# Altium schematic sheet Sheet1.SchDoc
size A4
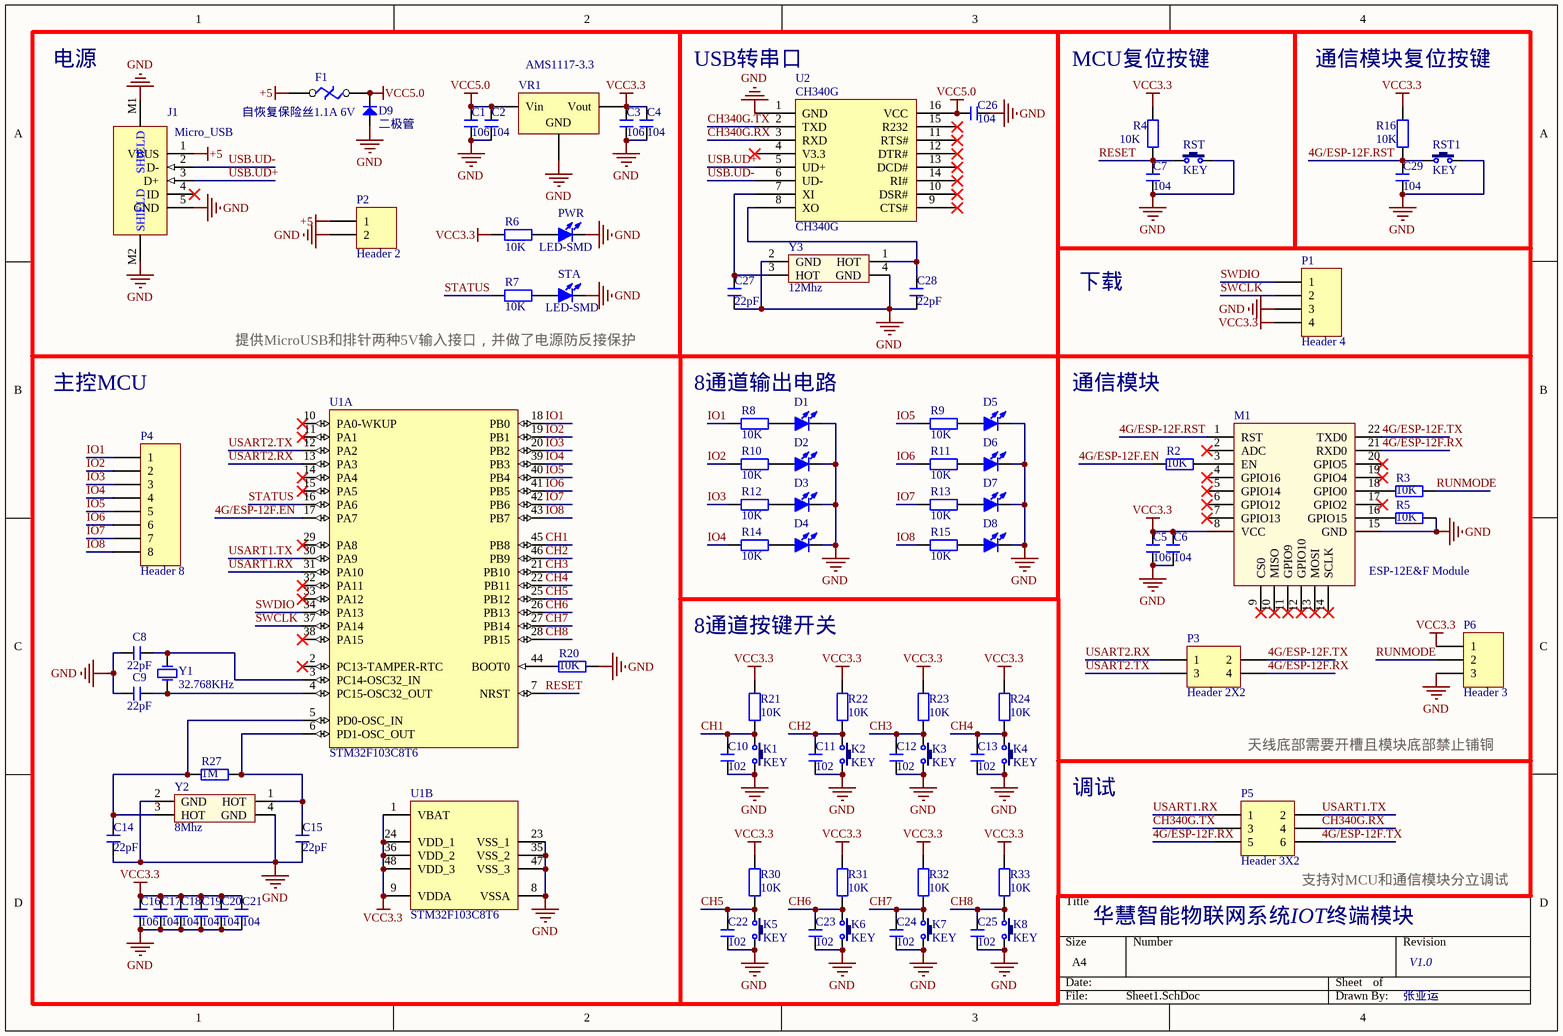
[diagram p0: Sheet1.SchDoc]

## Parts
C1  106  [LC-0603_C]
C2  104  [LC-0603_C]
C3  106  [LC-0603_C]
C4  104  [LC-0603_C]
C5  106  [LC-0603_C]
C6  104  [LC-0603_C]
C7  104  [LC-0603_C]
C8  22pF  [LC-0603_C]
C9  22pF  [LC-0603_C]
C10  102  [LC-0603_C]
C11  102  [LC-0603_C]
C12  102  [LC-0603_C]
C13  102  [LC-0603_C]
C14  22pF  [LC-0603_C]
C15  22pF  [LC-0603_C]
C16  106  [LC-0603_C]
C17  104  [LC-0603_C]
C18  104  [LC-0603_C]
C19  104  [LC-0603_C]
C20  104  [LC-0603_C]
C21  104  [LC-0603_C]
C22  102  [LC-0603_C]
C23  102  [LC-0603_C]
C24  102  [LC-0603_C]
C25  102  [LC-0603_C]
C26  104  [LC-0603_C]
C27  22pF  [LC-0603_C]
C28  22pF  [LC-0603_C]
C29  104  [LC-0603_C]
D1  LED-SMD  [LC-0603_LED_S1]  (value not drawn)
D2  LED-SMD  [LC-0603_LED_S1]  (value not drawn)
D3  LED-SMD  [LC-0603_LED_S1]  (value not drawn)
D4  LED-SMD  [LC-0603_LED_S1]  (value not drawn)
D5  LED-SMD  [LC-0603_LED_S1]  (value not drawn)
D6  LED-SMD  [LC-0603_LED_S1]  (value not drawn)
D7  LED-SMD  [LC-0603_LED_S1]  (value not drawn)
D8  LED-SMD  [LC-0603_LED_S1]  (value not drawn)
D9  二极管  [LC-SOD-323]
F1  自恢复保险丝1.1A 6V  [LC-1206_R]
J1  Micro_USB  [USB-MICRO_B]
K1  KEY  [SWT3*4]
K2  KEY  [SWT3*4]
K3  KEY  [SWT3*4]
K4  KEY  [SWT3*4]
K5  KEY  [SWT3*4]
K6  KEY  [SWT3*4]
K7  KEY  [SWT3*4]
K8  KEY  [SWT3*4]
M1  ESP-12E&F Module  [ESP-12E&F Module]
P1  Header 4  [HDR1X4]
P2  Header 2  [HDR1X2]
P3  Header 2X2  [HDR2X2]
P4  Header 8  [HDR1X8]
P5  Header 3X2  [HDR2X3]
P6  Header 3  [HDR1X3]
PWR  LED-SMD  [LC-0603_LED_S1]
R2  10K  [LC-0603_R]
R3  10K  [LC-0603_R]
R4  10K  [LC-0603_R]
R5  10K  [LC-0603_R]
R6  10K  [LC-0603_R]
R7  10K  [LC-0603_R]
R8  10K  [LC-0603_R]
R9  10K  [LC-0603_R]
R10  10K  [LC-0603_R]
R11  10K  [LC-0603_R]
R12  10K  [LC-0603_R]
R13  10K  [LC-0603_R]
R14  10K  [LC-0603_R]
R15  10K  [LC-0603_R]
R16  10K  [LC-0603_R]
R20  10K  [LC-0603_R]
R21  10K  [LC-0603_R]
R22  10K  [LC-0603_R]
R23  10K  [LC-0603_R]
R24  10K  [LC-0603_R]
R27  1M  [LC-0603_R]
R30  10K  [LC-0603_R]
R31  10K  [LC-0603_R]
R32  10K  [LC-0603_R]
R33  10K  [LC-0603_R]
RST  KEY  [SWT3*4]
RST1  KEY  [SWT3*4]
STA  LED-SMD  [LC-0603_LED_S1]
U1  STM32F103C8T6  [STM-LQFP48_L]  (parts A,B of 2)
U2  CH340G  [SOIC-16_150mil]
VR1  AMS1117-3.3  [LC-SOT-223]
Y1  32.768KHz  [LC-SMD-3215_2P FC - 135]
Y2  8Mhz  [LC-SMD-3225_4P]
Y3  12Mhz  [LC-SMD-3225_4P]

## Nets
+5: F1.1 J1.1(VBUS) P2.1
GND: C1.2 C2.2 C3.2 C4.2 C5.2 C6.2 C7.1 C8.1 C9.1 C10.2 C11.2 C12.2 C13.2 C14.2 C15.2 C16.2 C17.2 C18.2 C19.2 C20.2 C21.2 C22.2 C23.2 C24.2 C25.2 C26.1 C27.2 C28.2 C29.1 D1.2(K) D2.2(K) D3.2(K) D4.2(K) D5.2(K) D6.2(K) D7.2(K) D8.2(K) D9.1 J1.5(GND) J1.M1(SHIELD) J1.M2(SHIELD) K1.2 K2.2 K3.2 K4.2 K5.2 K6.2 K7.2 K8.2 M1.15(GND) P1.3 P2.2 P6.3 PWR.2(K) R5.1 R20.1 RST.2 RST1.2 STA.2(K) U1.8(VSSA) U1.23(VSS_1) U1.35(VSS_2) U1.47(VSS_3) U2.1(GND) VR1.1(GND) Y2.2(GND) Y2.4(GND) Y3.2(GND) Y3.4(GND)
VCC3.3: C3.1 C4.1 C5.1 C6.1 C16.1 C17.1 C18.1 C19.1 C20.1 C21.1 M1.8(VCC) P1.4 P6.1 R4.2 R6.1 R16.2 R21.1 R22.1 R23.1 R24.1 R30.1 R31.1 R32.1 R33.1 U1.1(VBAT) U1.9(VDDA) U1.24(VDD_1) U1.36(VDD_2) U1.48(VDD_3) VR1.2(Vout)
VCC5.0: C1.1 C2.1 C26.2 D9.2 F1.2 U2.16(VCC) VR1.3(Vin)
4G/ESP-12F.EN: R2.2 U1.17(PA7)
4G/ESP-12F.RST: C29.2 M1.1(RST) R16.1 RST1.1
4G/ESP-12F.RX: M1.21(RXD0) P3.4 P5.5
4G/ESP-12F.TX: M1.22(TXD0) P3.2 P5.6
CH1: C10.1 K1.1 R21.2 U1.45(PB8)
CH2: C11.1 K2.1 R22.2 U1.46(PB9)
CH3: C12.1 K3.1 R23.2 U1.21(PB10)
CH4: C13.1 K4.1 R24.2 U1.22(PB11)
CH5: C22.1 K5.1 R30.2 U1.25(PB12)
CH6: C23.1 K6.1 R31.2 U1.26(PB13)
CH7: C24.1 K7.1 R32.2 U1.27(PB14)
CH8: C25.1 K8.1 R33.2 U1.28(PB15)
CH340G.RX: P5.4 U2.3(RXD)
CH340G.TX: P5.3 U2.2(TXD)
IO1: P4.1 R8.1 U1.18(PB0)
IO2: P4.2 R10.1 U1.19(PB1)
IO3: P4.3 R12.1 U1.20(PB2)
IO4: P4.4 R14.1 U1.39(PB3)
IO5: P4.5 R9.1 U1.40(PB4)
IO6: P4.6 R11.1 U1.41(PB5)
IO7: P4.7 R13.1 U1.42(PB6)
IO8: P4.8 R15.1 U1.43(PB7)
RESET: C7.2 R4.1 RST.1 U1.7(NRST)
RUNMODE: P6.2 R3.1
STATUS: R7.1 U1.16(PA6)
SWCLK: P1.2 U1.37(PA14)
SWDIO: P1.1 U1.34(PA13)
USART1.RX: P5.1 U1.31(PA10)
USART1.TX: P5.2 U1.30(PA9)
USART2.RX: P3.1 U1.13(PA3)
USART2.TX: P3.3 U1.12(PA2)
USB.UD+: J1.3(D+) U2.5(UD+)
USB.UD-: J1.2(D-) U2.6(UD-)
NetC8_2: C8.2 U1.3(PC14-OSC32_IN) Y1.2(OSC2)
NetC9_2: C9.2 U1.4(PC15-OSC32_OUT) Y1.1(OSC1)
NetC14_1: C14.1 R27.2 U1.5(PD0-OSC_IN) Y2.3(HOT)
NetC15_1: C15.1 R27.1 U1.6(PD1-OSC_OUT) Y2.1(HOT)
NetC27_1: C27.1 U2.7(XI) Y3.3(HOT)
NetC28_1: C28.1 U2.8(XO) Y3.1(HOT)
NetD1_1: D1.1(A) R8.2
NetD2_1: D2.1(A) R10.2
NetD3_1: D3.1(A) R12.2
NetD4_1: D4.1(A) R14.2
NetD5_1: D5.1(A) R9.2
NetD6_1: D6.1(A) R11.2
NetD7_1: D7.1(A) R13.2
NetD8_1: D8.1(A) R15.2
NetM1_3: M1.3(EN) R2.1
NetM1_16: M1.16(GPIO15) R5.2
NetM1_18: M1.18(GPIO0) R3.2
NetPWR_1: PWR.1(A) R6.2
NetR7_2: R7.2 STA.1(A)
NetR20_2: R20.2 U1.44(BOOT0)

Not connected (* = marked no-connect by the designer): J1 4(ID)*; M1 2(ADC)* 4(GPIO16)* 5(GPIO14)* 6(GPIO12)* 7(GPIO13)* 9(CS0)* 10(MISO)* 11(GPIO9)* 12(GPIO10)* 13(MOSI)* 14(SCLK)* 17(GPIO2)* 19(GPIO4)* 20(GPIO5)*; U1 2(PC13-TAMPER-RTC)* 10(PA0-WKUP)* 11(PA1)* 14(PA4)* 15(PA5)* 29(PA8)* 32(PA11)* 33(PA12)* 38(PA15)*; U2 4(V3.3)* 9(CTS#)* 10(DSR#)* 11(RTS#)* 12(DTR#)* 13(DCD#)* 14(RI#)* 15(R232)*

## Notes on the sheet
- 电源
- USB转串口
- (near R4) MCU复位按键
- (near R16) 通信模块复位按键
- 下载
- 提供MicroUSB和排针两种5V输入接口，并做了电源防反接保护
- 主控MCU
- 8通道输出电路
- 通信模块
- 8通道按键开关
- 天线底部需要开槽且模块底部禁止铺铜
- 调试
- 华慧智能物联网系统IOT终端模块
- (near P5) 支持对MCU和通信模块分立调试
- V1.0
- 张亚运

## Library data of the parts
C1-C29 = C: 无极性贴片电容; 版权归属: 源创客; BOM名称: 无极性贴片电容; 学习资源: www.ooocke.com
D1-D8 PWR STA = LED-SMD: 贴片LED; 版权归属: 源创客; BOM名称: 贴片LED; 学习资源: www.ooocke.com
D9 = 二极管: 普通二极管
F1 = F: 1206 贴片自恢复保险丝/保险管 PPTC MF-NSMF110-2 1.1A 6V
K1-K8 RST RST1 = KEY: 按键; BOM名称: 3x6轻触开关; 版权归属: 源创客; 学习资源: www.ooocke.com
P1 = Header 4: Header, 4-Pin; LatestRevisionDate: 17-Jul-2002; LatestRevisionNote: Re-released for DXP Platform.; Publisher: Altium Limited
P2 = Header 2: Header, 2-Pin; LatestRevisionDate: 17-Jul-2002; LatestRevisionNote: Re-released for DXP Platform.; Publisher: Altium Limited
P3 = Header 2X2: Header, 2-Pin, Dual row; LatestRevisionDate: 17-Jul-2002; LatestRevisionNote: Re-released for DXP Platform.; Publisher: Altium Limited
P4 = Header 8: Header, 8-Pin; LatestRevisionDate: 17-Jul-2002; LatestRevisionNote: Re-released for DXP Platform.; Publisher: Altium Limited
P5 = Header 3X2: Header, 3-Pin, Dual row; LatestRevisionDate: 17-Jul-2002; LatestRevisionNote: Re-released for DXP Platform.; Publisher: Altium Limited
P6 = Header 3: Header, 3-Pin; LatestRevisionDate: 17-Jul-2002; LatestRevisionNote: Re-released for DXP Platform.; Publisher: Altium Limited
R2-R16 R20-R24 R27 R30-R33 = R: 电阻; ComponentLink1Description: 供应商链接; ComponentLink1URL: http://www.szlcsc.com/product/details_24078.html; Package: 0603; Supplier: LC; SuppliersPartNumber: C23345
U1 = STM32F103C8T6: ARM Cortex-M3 32-bit MCU, 64 KB Flash, 20 KB Internal RAM, 37 I/Os, 48-pin LQFP, -40 to 85 degC, Tray; A/D Converter: 2x12-bit (10 Channel); FLASH Size (Prog) (kB): 64; I/Os (High Current): 37; Internal RAM Size (kB): 20; Operating Frequency(F) (Processor speed) (MHz): 72; Supply Voltage(Vcc) min (V): 2; DatasheetVersion: Rev. 16; PackageVersion: Rev. 6, 06/2013; PackageReference: LQFP48; PackageDescription: 48-Pin Low Profile Quad Flat Package, 7 x 7 mm Body, 0.5 mm Pitch; Supplier 1: Digi-Key; Supplier Part Number 1: 497-6063-ND; Supplier 2: Farnell; Supplier Part Number 2: 1447637; Supplier 3: Newark; Supplier Part Number 3: 59M2182; Supplier 4: Newark; Supplier Part Number 4: 57P1222; Supplier 5: Mouser; Supplier Part Number 5: 511-STM32F103C8T6; Core: ARM Cortex-M3; Packing: Tray; Mounting Technology: Surface Mount; PartNumber: STM32F103C8T6; ComponentLink1Description: Manufacturer URL; ComponentLink1URL: http://www.st.com/web/en/home.html; ComponentLink2Description: Datasheet; ComponentLink2URL: http://www.st.com/st-web-ui/static/active/en/resource/technical/document/datasheet/CD00161566.pdf; ComponentLink3Description: Package Specification; ComponentLink3URL: http://www.st.com/st-web-ui/static/active/en/resource/technical/document/datasheet/DM00058181.pdf
U2 = CH340G: USB; ComponentLink1Description: 供应商链接; ComponentLink1URL: http://www.szlcsc.com/product/details_14927.html; Package: SOIC-16_150mil; Supplier: LC; SuppliersPartNumber: C14267
VR1 = SOT-223 AMS1117-3.3: 低压差线性稳压(LDO); ComponentLink1Description: 供应商链接; ComponentLink1URL: http://www.szlcsc.com/product/details_6652.html; Package: SOT-223; Supplier: LC; SuppliersPartNumber: C6186
Y1 = XTAL: 普通晶振; Published: 8-Jun-2000; LatestRevisionDate: 17-Jul-2002; LatestRevisionNote: Re-released for DXP Platform.; Publisher: Altium Limited
Y2 Y3 = XTAL_3225: 3225贴片无源晶振
J1 = Micro_USB: HelpURL: https://item.taobao.com/item.htm?spm=a230r.1.14.48.76bf5237G2R5N&id=522578920966&ns=1&abbucket=3#detail